# Altium schematic sheet DSP_GPIO_Part1.SchDoc
size A4
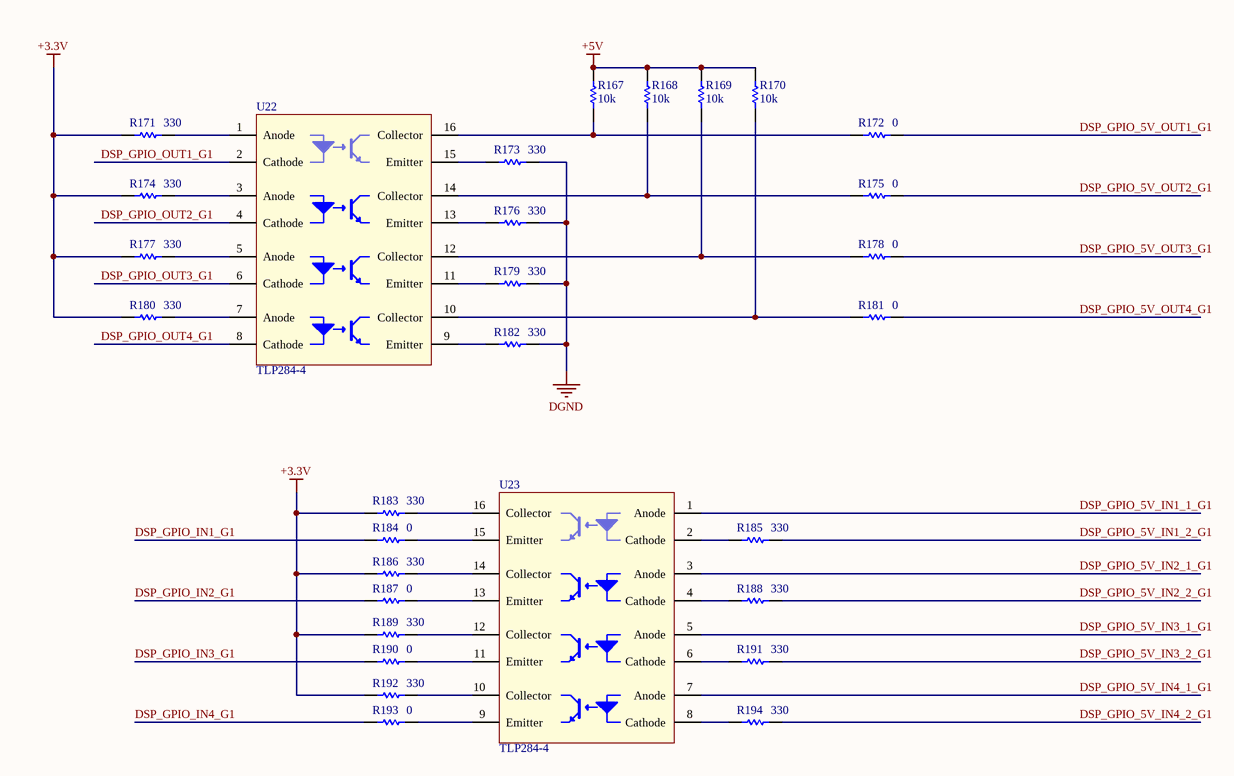
[diagram p0: DSP_GPIO_Part1.SchDoc]

## Parts
R167  value 10k  [1608[0603]]  (hidden comment: Res1)
R168  value 10k  [1608[0603]]  (hidden comment: Res1)
R169  value 10k  [1608[0603]]  (hidden comment: Res1)
R170  value 10k  [1608[0603]]  (hidden comment: Res1)
R171  value 330  [1608[0603]]  (hidden comment: Res1)
R172  value 0  [1608[0603]]  (hidden comment: Res1)
R173  value 330  [1608[0603]]  (hidden comment: Res1)
R174  value 330  [1608[0603]]  (hidden comment: Res1)
R175  value 0  [1608[0603]]  (hidden comment: Res1)
R176  value 330  [1608[0603]]  (hidden comment: Res1)
R177  value 330  [1608[0603]]  (hidden comment: Res1)
R178  value 0  [1608[0603]]  (hidden comment: Res1)
R179  value 330  [1608[0603]]  (hidden comment: Res1)
R180  value 330  [1608[0603]]  (hidden comment: Res1)
R181  value 0  [1608[0603]]  (hidden comment: Res1)
R182  value 330  [1608[0603]]  (hidden comment: Res1)
R183  value 330  [1608[0603]]  (hidden comment: Res1)
R184  value 0  [1608[0603]]  (hidden comment: Res1)
R185  value 330  [1608[0603]]  (hidden comment: Res1)
R186  value 330  [1608[0603]]  (hidden comment: Res1)
R187  value 0  [1608[0603]]  (hidden comment: Res1)
R188  value 330  [1608[0603]]  (hidden comment: Res1)
R189  value 330  [1608[0603]]  (hidden comment: Res1)
R190  value 0  [1608[0603]]  (hidden comment: Res1)
R191  value 330  [1608[0603]]  (hidden comment: Res1)
R192  value 330  [1608[0603]]  (hidden comment: Res1)
R193  value 0  [1608[0603]]  (hidden comment: Res1)
R194  value 330  [1608[0603]]  (hidden comment: Res1)
U22  TLP284-4  [TLP284-4]
U23  TLP284-4  [TLP284-4]

## Nets
+3.3V: R171.1 R174.1 R177.1 R180.1 R183.1 R186.1 R189.1 R192.1
+5V: R167.2 R168.2 R169.2 R170.2
DGND: R173.2 R176.2 R179.2 R182.2
DSP_GPIO_5V_IN1_1_G1: U23.1(Anode)
DSP_GPIO_5V_IN1_2_G1: R185.2
DSP_GPIO_5V_IN2_1_G1: U23.3(Anode)
DSP_GPIO_5V_IN2_2_G1: R188.2
DSP_GPIO_5V_IN3_1_G1: U23.5(Anode)
DSP_GPIO_5V_IN3_2_G1: R191.2
DSP_GPIO_5V_IN4_1_G1: U23.7(Anode)
DSP_GPIO_5V_IN4_2_G1: R194.2
DSP_GPIO_5V_OUT1_G1: R172.2
DSP_GPIO_5V_OUT2_G1: R175.2
DSP_GPIO_5V_OUT3_G1: R178.2
DSP_GPIO_5V_OUT4_G1: R181.2
DSP_GPIO_IN1_G1: R184.1
DSP_GPIO_IN2_G1: R187.1
DSP_GPIO_IN3_G1: R190.1
DSP_GPIO_IN4_G1: R193.1
DSP_GPIO_OUT1_G1: U22.2(Cathode)
DSP_GPIO_OUT2_G1: U22.4(Cathode)
DSP_GPIO_OUT3_G1: U22.6(Cathode)
DSP_GPIO_OUT4_G1: U22.8(Cathode)
NetR167_1: R167.1 R172.1 U22.16(Collector)
NetR168_1: R168.1 R175.1 U22.14(Collector)
NetR169_1: R169.1 R178.1 U22.12(Collector)
NetR170_1: R170.1 R181.1 U22.10(Collector)
NetR171_2: R171.2 U22.1(Anode)
NetR173_1: R173.1 U22.15(Emitter)
NetR174_2: R174.2 U22.3(Anode)
NetR176_1: R176.1 U22.13(Emitter)
NetR177_2: R177.2 U22.5(Anode)
NetR179_1: R179.1 U22.11(Emitter)
NetR180_2: R180.2 U22.7(Anode)
NetR182_1: R182.1 U22.9(Emitter)
NetR183_2: R183.2 U23.16(Collector)
NetR184_2: R184.2 U23.15(Emitter)
NetR185_1: R185.1 U23.2(Cathode)
NetR186_2: R186.2 U23.14(Collector)
NetR187_2: R187.2 U23.13(Emitter)
NetR188_1: R188.1 U23.4(Cathode)
NetR189_2: R189.2 U23.12(Collector)
NetR190_2: R190.2 U23.11(Emitter)
NetR191_1: R191.1 U23.6(Cathode)
NetR192_2: R192.2 U23.10(Collector)
NetR193_2: R193.2 U23.9(Emitter)
NetR194_1: R194.1 U23.8(Cathode)

## Library data of the parts
R167-R194 = Res1: Resistor; Published: 8-Jun-2000; LatestRevisionDate: 17-Jul-2002; LatestRevisionNote: Re-released for DXP Platform.; PackageReference: AXIAL-0.3; Publisher: Altium Limited; PackageDescription: Axial Device, Thru-Hole; 2 Leads; 0.3 in Pin Spacing